# EAGLE design Keg Cop - Daisy Chain (EAGLE 9.5.2)
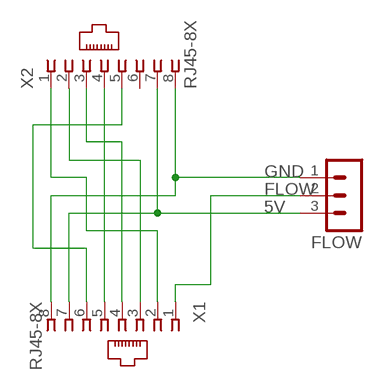
[diagram p0: schematic, sheet 1]

## Parts
FLOW  HDR-3  [HDR-3_VERT]
X1  RJ45-8X  [RJ45-NO-SHIELD]
X2  RJ45-8X  [RJ45-NO-SHIELD]

## Nets
5V: FLOW.3 X1.7 X2.7
FLOW: FLOW.2 X1.1
GND: FLOW.1 X1.8 X2.8
N$1: X1.2 X2.1
N$2: X1.3 X2.2
N$3: X1.4 X2.3
N$5: X1.5 X2.4
N$7: X1.6 X2.5
Unconnected: X2.6

## Library data of the parts
FLOW = Donnie:HDR-3: PIN HEADER
X1 X2 = con-tycoelectronics:RJ45: CORCOM Modular RJ Jacks No Shield Source: www.tycoelectronics.com .. ENG_DS_1654001_1099_RJ_L_0507.pdf; MPN: RJ45-8X; OC_FARNELL: unknown; OC_NEWARK: 16R6101

## Board
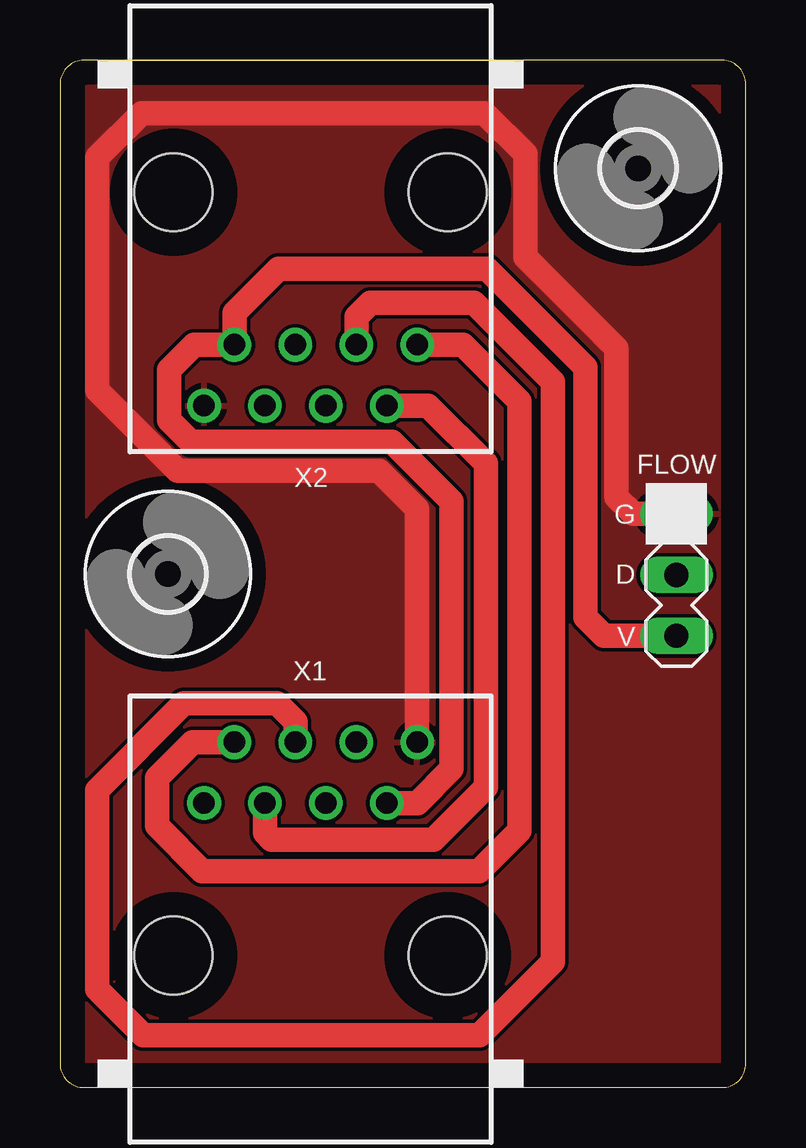
[diagram p1: board, top side]
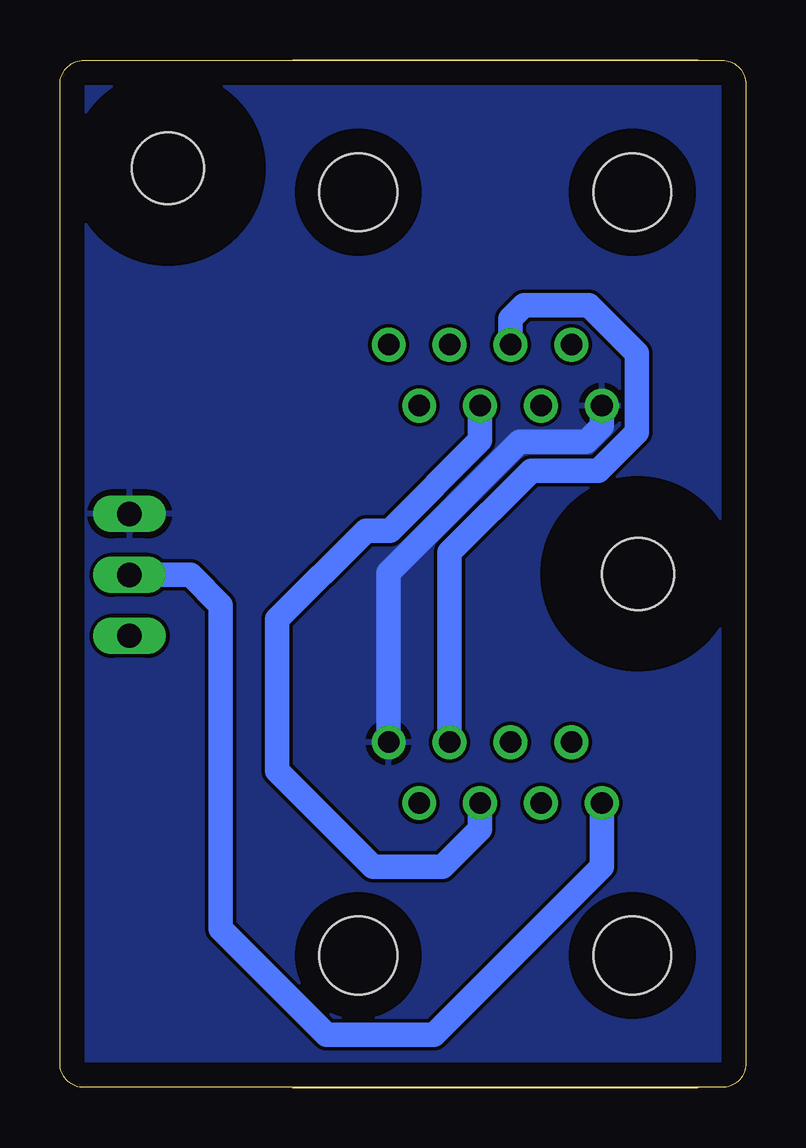
[diagram p2: board, bottom side, seen from below]

Size 28.6 x 42.82 mm. Coordinates in mm from the lower left corner, seen from the top.
Outline: 0,41.81 0,1.01 arc90 1,0.01 27.6,0.01 arc90 28.6,1.01 28.6,41.81 arc90 27.6,42.81 1,42.81 arc90 0,41.81
Copper layers (1*16): Top 0.035mm / dielectric 1.5mm / Bottom 0.035mm
Design rules "default": minimum track width 6mil, minimum drill 0.35mm, track to track 6mil, track to pad 6mil, pad to pad 6mil, via to via 6mil, smd to smd 6mil, copper to edge 40mil, drill to drill 6mil, minimum pad ring 10mil, minimum via ring 8mil, stop-mask expansion 4mil, vias tented up to drill 0mil, thermal gap 10mil

### Footprints (pad centres in the part's own frame; a part is rotated, then mirrored left to right if it is on the bottom)
HDR-3_VERT = drill 1.016 long: 1 0,0; 2 2.54,0; 3 5.08,0
3,0 = hole 3: 0,0
RJ45-NO-SHIELD = drill 0.9 pad 1.4: 1 -4.445,6.35; 2 -3.175,8.89; 3 -1.905,6.35; 4 -0.635,8.89; 5 0.635,6.35; 6 1.905,8.89; 7 3.175,6.35; 8 4.445,8.89 | hole 3.251: -5.715,0; 5.715,0

### Placement (x,y rotation side)
FLOW  25.7,23.91 270 top
U$1  [3,0]  4.5,21.41 0 top
U$2  [3,0]  24.1,38.31 0 top
X1  10.45,5.51 0 top
X2  10.45,37.31 180 top

### Tracks (layer width: path | path; a pad name or v marks a point on that pad's centre or on a via)
5V
  Top 1.016: X1.7 14.9,11.86 16.33,13.29 16.33,24.43 13.85,26.91 5.45,26.91 4.55,27.81 4.55,29.91 5.6,30.96 X2.7 7.28,32.29 9.11,34.12 17.79,34.12 21.9,30.01 21.9,19.61 22.68,18.83 FLOW.3
FLOW
  Bottom 1.016: X1.1 6,9.21 13,2.21 17.49,2.21 21.9,6.62 21.9,20.11 23.16,21.37 FLOW.2
GND
  Top 1.016: X1.8 14.89,24.12 13.3,25.71 4.9,25.71 1.55,29.06 1.55,38.76 3.4,40.61 17.7,40.61 19.4,38.91 19.4,34.61 23.2,30.81 23.2,24.61 23.9,23.91 FLOW.1
  Bottom 1.016: X1.8 14.89,21.47 9.45,26.91 6.65,26.91 6,27.56 X2.8
  pour Top: -0.2,43.01 28.8,43.01 28.8,-0.09 -0.2,-0.09
  pour Bottom: -0.2,43.01 28.8,43.01 28.8,-0.09 -0.2,-0.09
N$1
  Top 1.016: X2.1 16.8,30.96 19.15,28.61 19.15,10.71 17.47,9.03 5.93,9.03 4.05,10.91 4.05,12.91 5.54,14.4 X1.2
N$2
  Top 1.016: X1.3 8.54,10.62 8.83,10.33 15.57,10.33 17.75,12.51 17.75,26.01 15.34,28.42 X2.2
N$3
  Top 1.016: X2.3 12.36,32.12 12.95,32.71 17.25,32.71 20.55,29.41 20.55,5.25 17.49,2.19 3.46,2.19 1.54,4.11 1.54,12.4 5.15,16.01 9.05,16.01 9.81,15.25 X1.4
N$5
  Bottom 1.016: X1.5 11.09,10.78 12.65,9.21 15.55,9.21 19.55,13.21 19.55,19.51 15.85,23.21 14.85,23.21 11.09,26.98 X2.4
N$7
  Bottom 1.016: X2.5 9.81,32.05 9.25,32.61 6.55,32.61 4.55,30.61 4.55,27.31 6.15,25.71 8.95,25.71 12.36,22.31 X1.6

### Text on the board
tNames: G | D | V